# Altium project PWR board_Project.PrjPCB
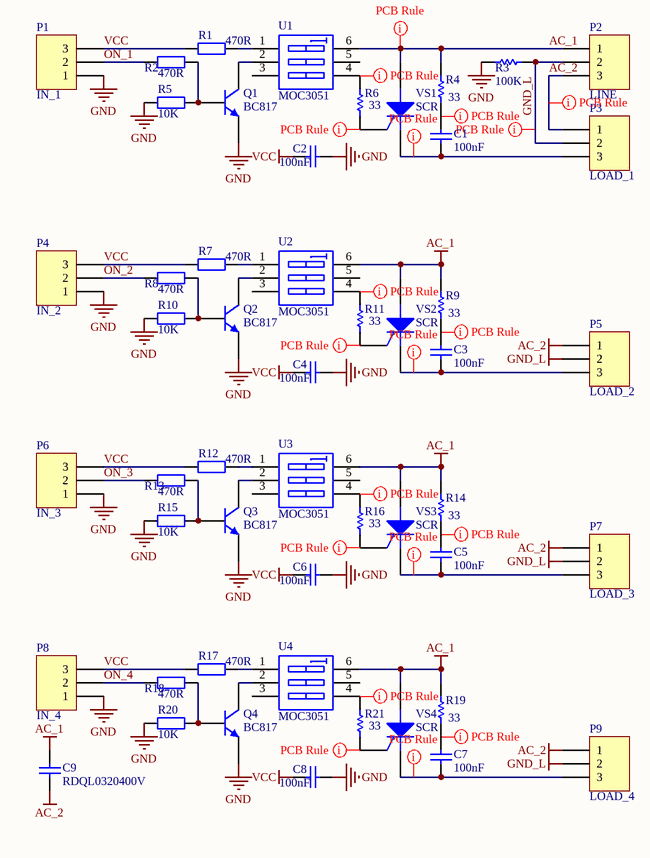
[diagram p0: PWR board_CHM.SchDoc]
1 sheet, 51 parts. Net scope: global (net labels, ports and power ports of the same name join across sheets).
Board file: PWR board_PCB.PcbDoc

## Sheet PWR board_CHM.SchDoc
size A4; PageSetup: Record=PageOptions|CenterHorizontal=True|CenterVertical=True|PrintScale=1.39|XCorrection=1.00|YCorrection=1.00|PrintKind=1|BorderSize=5000000|LeftOffset=0|BottomOffset=0|Orientation=2|PaperLength=5940|PaperWidth=4200|Scale=100|PaperSource=7|PrintQuality=600|MediaType=1|DitherType=10|PrintScaleMode=1|PaperKind=A3

### Parts
C1  100nF  [AXIAL-0.7]
C2  value 100nF  [0805]  (hidden comment: C0805)
C3  100nF  [AXIAL-0.7]
C4  value 100nF  [0805]  (hidden comment: C0805)
C5  100nF  [AXIAL-0.7]
C6  value 100nF  [0805]  (hidden comment: C0805)
C7  100nF  [AXIAL-0.7]
C8  value 100nF  [0805]  (hidden comment: C0805)
C9  RDQL0320400V  [AXIAL-0.7]
P1  IN_1  [DG390-5.0-03P]
P2  LINE  [DG390-5.0-03P]
P3  LOAD_1  [DG390-5.0-03P]
P4  IN_2  [DG390-5.0-03P]
P5  LOAD_2  [DG390-5.0-03P]
P6  IN_3  [DG390-5.0-03P]
P7  LOAD_3  [DG390-5.0-03P]
P8  IN_4  [DG390-5.0-03P]
P9  LOAD_4  [DG390-5.0-03P]
Q1  BC817  [SOT23_M]
Q2  BC817  [SOT23_M]
Q3  BC817  [SOT23_M]
Q4  BC817  [SOT23_M]
R1  value 470R  [6-0805_N]  (hidden comment: Res2)
R2  value 470R  [6-0805_N]  (hidden comment: Res2)
R3  value 100K  [AXIAL-0.5]  (hidden comment: Res Semi)
R4  value 33  [AXIAL-0.5]  (hidden comment: Res Semi)
R5  value 10K  [6-0805_N]  (hidden comment: Res2)
R6  value 33  [AXIAL-0.5]  (hidden comment: Res Semi)
R7  value 470R  [6-0805_N]  (hidden comment: Res2)
R8  value 470R  [6-0805_N]  (hidden comment: Res2)
R9  value 33  [AXIAL-0.5]  (hidden comment: Res Semi)
R10  value 10K  [6-0805_N]  (hidden comment: Res2)
R11  value 33  [AXIAL-0.5]  (hidden comment: Res Semi)
R12  value 470R  [6-0805_N]  (hidden comment: Res2)
R13  value 470R  [6-0805_N]  (hidden comment: Res2)
R14  value 33  [AXIAL-0.5]  (hidden comment: Res Semi)
R15  value 10K  [6-0805_N]  (hidden comment: Res2)
R16  value 33  [AXIAL-0.5]  (hidden comment: Res Semi)
R17  value 470R  [6-0805_N]  (hidden comment: Res2)
R18  value 470R  [6-0805_N]  (hidden comment: Res2)
R19  value 33  [AXIAL-0.5]  (hidden comment: Res Semi)
R20  value 10K  [6-0805_N]  (hidden comment: Res2)
R21  value 33  [AXIAL-0.5]  (hidden comment: Res Semi)
U1  MOC3051  [DIP-6]
U2  MOC3051  [DIP-6]
U3  MOC3051  [DIP-6]
U4  MOC3051  [DIP-6]
VS1  SCR  [Super-TO-247AC]
VS2  SCR  [Super-TO-247AC]
VS3  SCR  [Super-TO-247AC]
VS4  SCR  [Super-TO-247AC]

### Nets
AC_1: C9.2 P2.1 R4.2 R9.2 R14.2 R19.2 U1.6(B1) U2.6(B1) U3.6(B1) U4.6(B1) VS1.1(A) VS2.1(A) VS3.1(A) VS4.1(A)
AC_2: C9.1 P2.3 P3.1 P5.1 P7.1 P9.1
GND: C2.2 C4.2 C6.2 C8.2 P1.1 P4.1 P6.1 P8.1 Q1.3(E) Q2.3(E) Q3.3(E) Q4.3(E) R3.2 R5.1 R10.1 R15.1 R20.1
GND_L: P2.2 P3.2 P5.2 P7.2 P9.2 R3.1
VCC: C2.1 C4.1 C6.1 C8.1 P1.3 P4.3 P6.3 P8.3 R1.1 R7.1 R12.1 R17.1
ON_1: P1.2 R2.2
ON_2: P4.2 R8.2
ON_3: P6.2 R13.2
ON_4: P8.2 R18.2
NetC1_1: C1.1 P3.3 VS1.3(K)
NetC1_2: C1.2 R4.1
NetC3_1: C3.1 P5.3 VS2.3(K)
NetC3_2: C3.2 R9.1
NetC5_1: C5.1 P7.3 VS3.3(K)
NetC5_2: C5.2 R14.1
NetC7_1: C7.1 P9.3 VS4.3(K)
NetC7_2: C7.2 R19.1
NetQ1_1: Q1.1(C) U1.2(A2)
NetQ1_2: Q1.2(B) R2.1 R5.2
NetQ2_1: Q2.1(C) U2.2(A2)
NetQ2_2: Q2.2(B) R8.1 R10.2
NetQ3_1: Q3.1(C) U3.2(A2)
NetQ3_2: Q3.2(B) R13.1 R15.2
NetQ4_1: Q4.1(C) U4.2(A2)
NetQ4_2: Q4.2(B) R18.1 R20.2
NetR1_2: R1.2 U1.1(A1)
NetR6_1: R6.1 VS1.2(G)
NetR6_2: R6.2 U1.4(B3)
NetR7_2: R7.2 U2.1(A1)
NetR11_1: R11.1 VS2.2(G)
NetR11_2: R11.2 U2.4(B3)
NetR12_2: R12.2 U3.1(A1)
NetR16_1: R16.1 VS3.2(G)
NetR16_2: R16.2 U3.4(B3)
NetR17_2: R17.2 U4.1(A1)
NetR21_1: R21.1 VS4.2(G)
NetR21_2: R21.2 U4.4(B3)

Not connected (* = marked no-connect by the designer): U1 3(A3) 5(B2); U2 3(A3) 5(B2); U3 3(A3) 5(B2); U4 3(A3) 5(B2)

### Layout directives
rule Undefined; rule Width Constraint [Pref Width = 40mil    Min Width = 10mil    Max Width = 50mil]: GND_L, NetC1_2, NetC3_2, NetC5_2, NetC7_2, NetR6_1, NetR6_2, NetR11_1, NetR11_2, NetR16_1, NetR16_2, NetR21_1, NetR21_2
rule Undefined; rule Width Constraint [Pref Width = 120mil    Min Width = 40mil    Max Width = 200mil]: AC_1, AC_2, NetC1_1, NetC3_1, NetC5_1, NetC7_1

### Library data of the parts
C1 C3 C5 C7 = HFZ222MBFEJ0K: Ceramic High Voltage Disc Capacitor, Class 2: 2200pF 6kV K 2000; Note: See Datasheet for other lead types & tolerances; Value: 2.2nF; Published: 17-Dec-2003; DatasheetDocument: 11-Dec-2001; PackageDocument: 2-Aug-2001; PackageReference: CAPRD12.5-25X5; Publisher: Altium Limited; ComponentLink1Description: Manufacturer Link; ComponentLink1URL: http://www.vishay.com/; ComponentLink2Description: Datasheet; ComponentLink2URL: http://www.vishay.com/docs/22161/h.pdf
C2 C4 C6 C8 = C0805: Ceramic Chip Capacitor - Standard; Note: Footprint corresponds to dimensions for bulk cassette packaging. This case size has tightened tolerances.; Published: 17-Jul-2002; LatestRevisionDate: 19-Mar-2004; LatestRevisionNote: Silkscreen size reduced.; DatasheetDocument: Mar-2001; PackageDocument: Mar-2001; PackageReference: 0805; Publisher: Altium Limited; Code_JEITA: 0805; Code_IPC: 2012[0805]; ComponentLink1Description: Manufacturer Link; ComponentLink1URL: http://www.kemet.com/; ComponentLink2Description: Datasheet; ComponentLink2URL: http://www.kemet.com/kemet/web/homepage/kechome.nsf/vapubfilesname/F3102TA.pdf/$file/F3102TA.pdf
C9 = RDQL0320400V: Ceramic Singlelayer Tubular Capacitor: 400V with Controlled Short-term Stability (KzK), 20mm tube length; Note: See Datasheet for other packages & tolerances; Value: 2pF; Published: 17-Dec-2003; DatasheetDocument: 3-Sep-2000; PackageReference: CAPRT17.5-21X3.5; Publisher: Altium Limited; ComponentLink1Description: Manufacturer Link; ComponentLink1URL: http://www.vishay.com/; ComponentLink2Description: Datasheet; ComponentLink2URL: http://www.vishay.com/docs/22028/rdq.pdf
P1-P9 = Header 3: Header, 3-Pin; LatestRevisionDate: 17-Jul-2002; LatestRevisionNote: Re-released for DXP Platform.; Publisher: Altium Limited
Q1-Q4 = QNPN: NPN Bipolar Transistor; pin to pad: 2>3 3>2; Published: 8-Jun-2000; LatestRevisionDate: 29-May-2009; LatestRevisionNote: IPC-7351 Footprint Added.; PackageVersion: Aug-1999; PackageReference: SOT-23B; Publisher: Altium Limited; PackageDescription: 3-Pin SOT-23 Package 0.95 mm Pitch, 2.4 mm Lead Span
R1 R2 R5 R7 R8 R10 R12 R13 R15 R17 R18 R20 = Res2: Resistor; Published: 8-Jun-2000; LatestRevisionDate: 17-Jul-2002; LatestRevisionNote: Re-released for DXP Platform.; PackageReference: AXIAL-0.4; Publisher: Altium Limited; PackageDescription: Axial Device, Thru-Hole; 2 Leads; 0.4 in Pin Spacing
R3 R4 R6 R9 R11 R14 R16 R19 R21 = Res Semi: Semiconductor Resistor; Published: 8-Jun-2000; LatestRevisionDate: 17-Jul-2002; LatestRevisionNote: Re-released for DXP Platform.; PackageReference: AXIAL-0.5; Publisher: Altium Limited; PackageDescription: Axial Device, Thru-Hole; 2 Leads; 0.5 in Pin Spacing
U1-U4 = SW DIP-3: DIP Switch, 3 Position, SPST; Published: 24-Mar-1999; LatestRevisionDate: 17-Jul-2002; LatestRevisionNote: Re-released for DXP Platform.; PackageReference: DIP-6; Publisher: Altium Limited; Code_JEDEC: MO-001-AM
VS1-VS4 = SCR: Silicon Controlled Rectifier; Published: 8-Jun-2000; LatestRevisionDate: 17-Jul-2002; LatestRevisionNote: Re-released for DXP Platform.; PackageReference: TO-220-AB; Publisher: Altium Limited; Code_JEDEC: TO-220-AB